# Altium schematic sheet bus.SchDoc: BUS (EPS and OBC)
size A4; DocumentNumber: 6; SheetNumber: 6; SheetTotal: 8
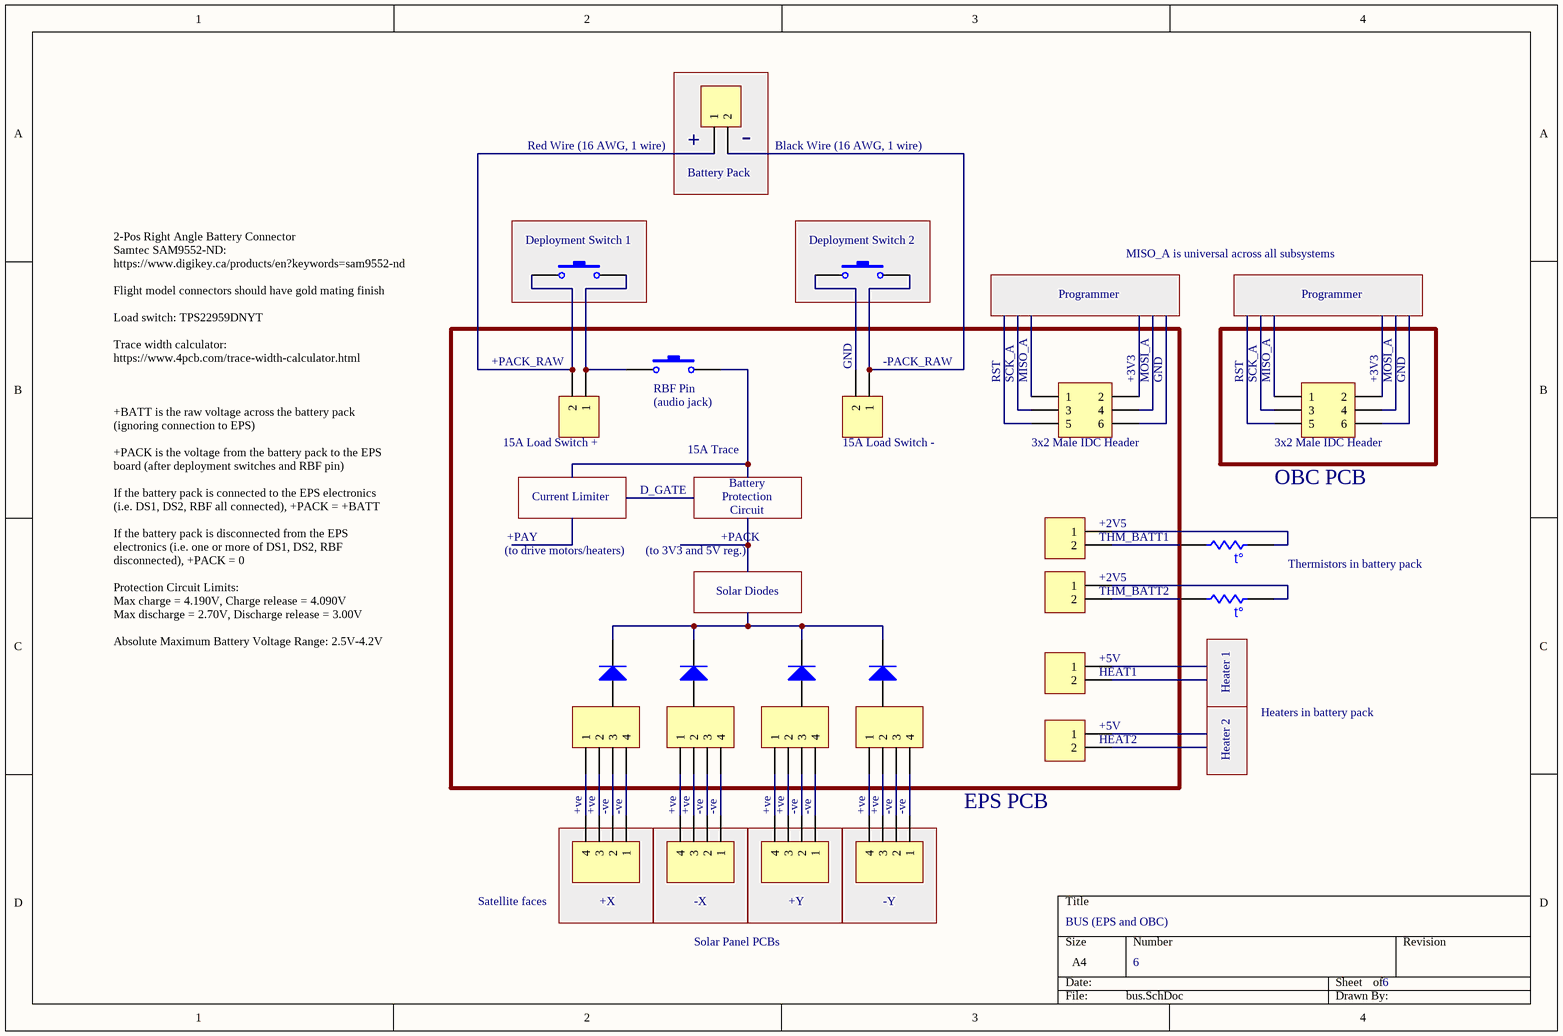
[diagram p0: bus.SchDoc]

## Parts
(Parts that share a designator on the sheet are numbered #1, #2 ... from top to bottom, then left to right.)
D?#1  Diode  [SMC]  (value not drawn)
D?#2  Diode  [SMC]  (value not drawn)
D?#3  Diode  [SMC]  (value not drawn)
D?#4  Diode  [SMC]  (value not drawn)
P?#1  Header 2  [HDR1X2]  (value not drawn)
P?#2  Header 3X2  [HDR2X3]  (value not drawn)
P?#3  Header 3X2  [HDR2X3]  (value not drawn)
P?#4  Header 2  [HDR1X2]  (value not drawn)
P?#5  Header 2  [HDR1X2]  (value not drawn)
P?#6  Header 2  [HDR1X2]  (value not drawn)
P?#7  Header 2  [HDR1X2]  (value not drawn)
P?#8  Header 2  [HDR1X2]  (value not drawn)
P?#9  Header 2  [HDR1X2]  (value not drawn)
P?#10  Header 4  [HDR1X4]  (value not drawn)
P?#11  Header 4  [HDR1X4]  (value not drawn)
P?#12  Header 4  [HDR1X4]  (value not drawn)
P?#13  Header 4  [HDR1X4]  (value not drawn)
P?#14  Header 4  [HDR1X4]  (value not drawn)
P?#15  Header 4  [HDR1X4]  (value not drawn)
P?#16  Header 4  [HDR1X4]  (value not drawn)
P?#17  Header 4  [HDR1X4]  (value not drawn)
RT?#1  Res Thermal  [6-0805_N]  (value not drawn)
RT?#2  Res Thermal  [6-0805_N]  (value not drawn)
S?#1  SW-PB  [SPST-2]  (value not drawn)
S?#2  SW-PB  [SPST-2]  (value not drawn)
S?#3  SW-PB  [SPST-2]  (value not drawn)

## Blocks framed on the sheet
-: P?#1
Deployment Switch 1: S?#1
Deployment Switch 2: S?#2

## Nets
NetD?#1_2: D?#1.2(K) D?#2.2(K) D?#3.2(K) D?#4.2(K)
NetP?#1_1: P?#1.1 P?#4.2 S?#1.1
NetP?#1_2: P?#1.2 P?#5.1 S?#2.2
NetP?#4_1: P?#4.1 S?#1.2 S?#3.1
NetP?#5_2: P?#5.2 S?#2.1
NetP?#6_1: P?#6.1 RT?#1.1
NetP?#6_2: P?#6.2 RT?#1.2
NetP?#7_1: P?#7.1 RT?#2.1
NetP?#7_2: P?#7.2 RT?#2.2
NetP?#10_1: P?#10.1 P?#14.4
NetP?#10_2: P?#10.2 P?#14.3
NetP?#10_3: P?#10.3 P?#14.2
NetP?#10_4: P?#10.4 P?#14.1
NetP?#11_1: P?#11.1 P?#15.4
NetP?#11_2: P?#11.2 P?#15.3
NetP?#11_3: P?#11.3 P?#15.2
NetP?#11_4: P?#11.4 P?#15.1
NetP?#12_1: P?#12.1 P?#16.4
NetP?#12_2: P?#12.2 P?#16.3
NetP?#12_3: P?#12.3 P?#16.2
NetP?#12_4: P?#12.4 P?#16.1
NetP?#13_1: P?#13.1 P?#17.4
NetP?#13_2: P?#13.2 P?#17.3
NetP?#13_3: P?#13.3 P?#17.2
NetP?#13_4: P?#13.4 P?#17.1

Not connected (* = marked no-connect by the designer): D?#1 1(A); D?#2 1(A); D?#3 1(A); D?#4 1(A); P?#2 1 2 3 4 5 6; P?#3 1 2 3 4 5 6; P?#8 1 2; P?#9 1 2; S?#3 2

## Notes on the sheet
- (near P?#1) Red Wire (16 AWG, 1 wire)
- (near P?#1) Battery Pack
- (near P?#1) +
- (near P?#1) Black Wire (16 AWG, 1 wire)
- Programmer
- MISO_A is universal across all subsystems
- 2-Pos Right Angle Battery Connector
  Samtec SAM9552-ND:
  https://www.digikey.ca/products/en?keywords=sam9552-nd
  Flight model connectors should have gold mating finish
  Load switch: TPS22959DNYT
  Trace width calculator: https://www.4pcb.com/trace-width-calculator.html
- (near P?#4) +PACK_RAW
- (near P?#5) GND
- (near P?#5) -PACK_RAW
- RST
- (near P?#2) SCK_A
- (near P?#2) MISO_A
- (near P?#2) +3V3
- (near P?#2) MOSI_A
- (near P?#2) GND
- (near P?#3) SCK_A
- (near P?#3) MISO_A
- (near P?#3) +3V3
- (near P?#3) MOSI_A
- (near P?#3) GND
- (near P?#4) 15A Load Switch +
- (near S?#3) (audio jack)
- (near S?#3) RBF Pin
- (near P?#5) 15A Load Switch -
- (near P?#2) 3x2 Male IDC Header
- (near P?#3) 3x2 Male IDC Header
- Current Limiter
- D_GATE
- 15A Trace
- Battery
- Protection
- Circuit
- OBC PCB
- +PAY
- (to drive motors/heaters)
- +PACK
- (to 3V3 and 5V reg.)
- (near P?#6) +2V5
- (near P?#6) THM_BATT1
- (near P?#7) +2V5
- (near RT?#1) Thermistors in battery pack
- +BATT is the raw voltage across the battery pack (ignoring connection to EPS)
  +PACK is the voltage from the battery pack to the EPS board (after deployment switches and RBF pin)
  If the battery pack is connected to the EPS electronics (i.e. DS1, DS2, RBF all connected), +PACK = +BATT
  If the battery pack is disconnected from the EPS electronics (i.e. one or more of DS1, DS2, RBF disconnected), +PACK = 0
  Protection Circuit Limits:
  Max charge = 4.190V, Charge release = 4.090V
  Max discharge = 2.70V, Discharge release = 3.00V
  Absolute Maximum Battery Voltage Range: 2.5V-4.2V
- Solar Diodes
- (near P?#7) THM_BATT2
- (near P?#8) HEAT1
- (near P?#8) +5V
- (near RT?#2) Heater 1
- Heaters in battery pack
- (near P?#9) HEAT2
- (near P?#9) +5V
- Heater 2
- (near P?#14) +ve
- (near P?#14) -ve
- (near P?#15) +ve
- (near P?#15) -ve
- (near P?#16) +ve
- (near P?#16) -ve
- (near P?#17) +ve
- (near P?#17) -ve
- EPS PCB
- Satellite faces
- +X
- -X
- +Y
- -Y
- Solar Panel PCBs
- (in symbol Res Thermal) t°

## Library data of the parts
D?#1-D?#4 = Diode: Default Diode; Published: 8-Jun-2000; LatestRevisionDate: 17-Jul-2002; LatestRevisionNote: Re-released for DXP Platform.; PackageVersion: Sep-1996; PackageReference: SMC; Publisher: Altium Limited; PackageDescription: DO-214-AB/SMC; 2 C-Bend Leads; Body 7.9 x 5.9 mm, inc. leads (LxW); Code_JEDEC: DO-214-AB
P?#1 P?#4-P?#9 = Header 2: Header, 2-Pin; LatestRevisionDate: 17-Jul-2002; LatestRevisionNote: Re-released for DXP Platform.; Publisher: Altium Limited
P?#2 P?#3 = Header 3X2: Header, 3-Pin, Dual row; LatestRevisionDate: 17-Jul-2002; LatestRevisionNote: Re-released for DXP Platform.; Publisher: Altium Limited
P?#10-P?#17 = Header 4: Header, 4-Pin; LatestRevisionDate: 17-Jul-2002; LatestRevisionNote: Re-released for DXP Platform.; Publisher: Altium Limited
RT?#1 RT?#2 = Res Thermal: Thermistor; Published: 24-Mar-1999; LatestRevisionDate: 29-May-2009; LatestRevisionNote: IPC-7351 Footprint Added.; PackageVersion: Mar-2003; PackageReference: 6-0805; Publisher: Altium Limited; PackageDescription: Chip Resistor 0805 Case Size; Code_IPC: RESC2012
S?#1-S?#3 = SW-PB: Switch; Published: 24-Mar-1999; LatestRevisionDate: 17-Jul-2002; LatestRevisionNote: Re-released for DXP Platform.; PackageReference: SPST-2; Publisher: Altium Limited; PackageDescription: Switch; 2 Leads